# Altium schematic sheet Charging.SchDoc
size A; SheetNumber: 4
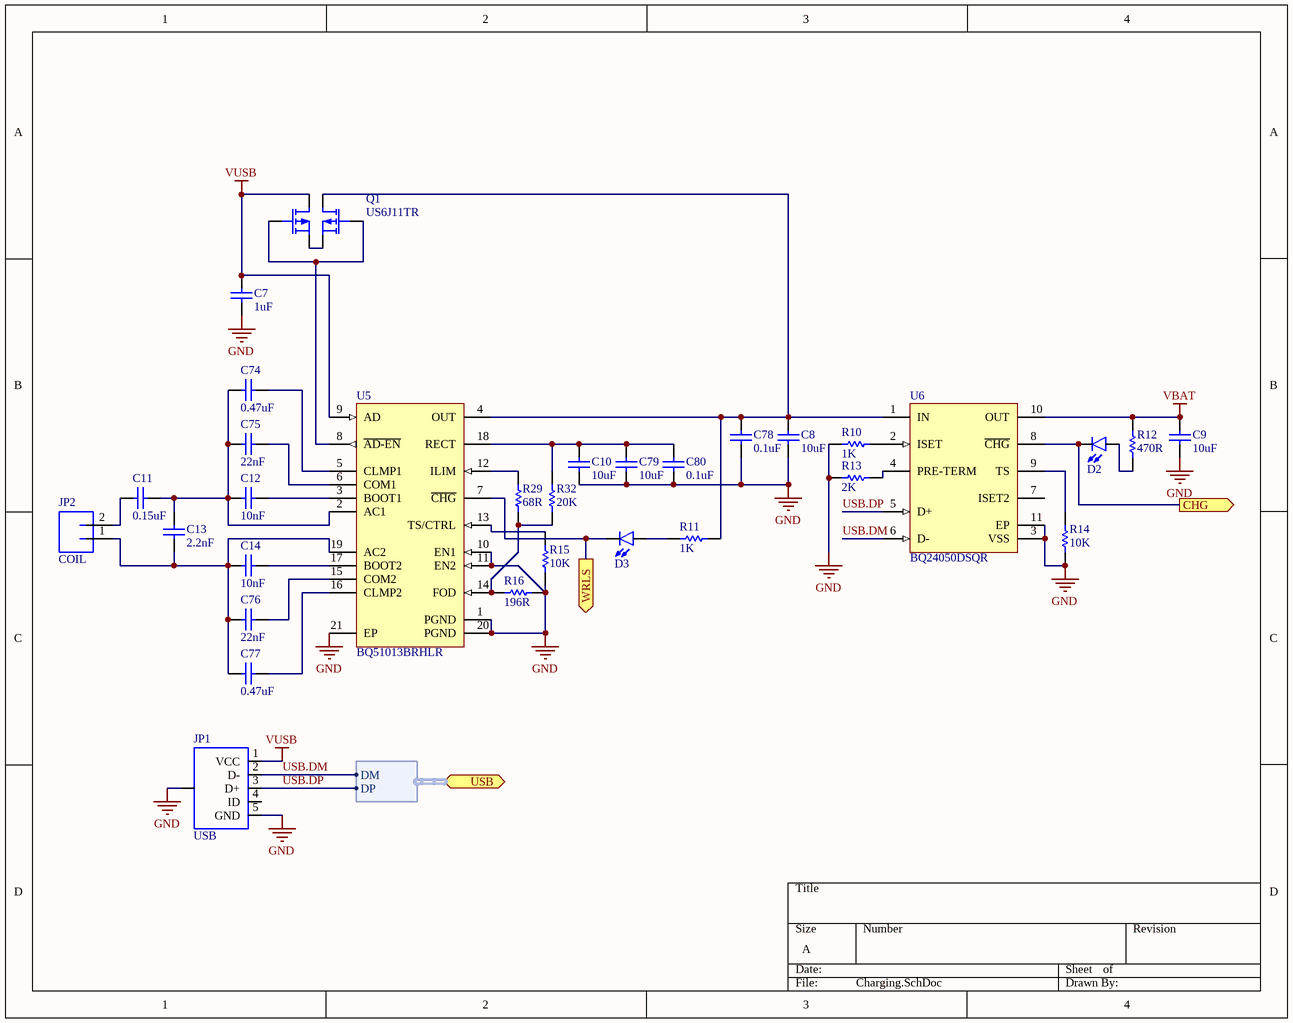
[diagram p0: Charging.SchDoc]

## Parts
C7  value 1uF  [C0402[1005X55]]  (hidden comment: 1uF 6.3V 0402)
C8  value 10uF  [C0402[1005X55]]  (hidden comment: 10uF 6.3V 0402)
C9  value 10uF  [C0402[1005X55]]  (hidden comment: 10uF 6.3V 0402)
C10  value 10uF  [C0603[1608X92]]  (hidden comment: 10uF 16V 0603)
C11  value 0.15uF  [C0402[1005X55]]  (hidden comment: 0.15uF 25V 0402)
C12  value 10nF  [C0402[1005X55]]  (hidden comment: 10nF 50V 0402)
C13  value 2.2nF  [C0402[1005X55]]  (hidden comment: 2.2nF 50V 0402)
C14  value 10nF  [C0402[1005X55]]  (hidden comment: 10nF 50V 0402)
C74  value 0.47uF  [C0402[1005X55]]  (hidden comment: 0.47uF 25V 0402)
C75  value 22nF  [C0402[1005X55]]  (hidden comment: 22nF 50V 0402)
C76  value 22nF  [C0402[1005X55]]  (hidden comment: 22nF 50V 0402)
C77  value 0.47uF  [C0402[1005X55]]  (hidden comment: 0.47uF 25V 0402)
C78  value 0.1uF  [C0402[1005X55]]  (hidden comment: 0.1uF 6.3V 0402)
C79  value 10uF  [C0603[1608X92]]  (hidden comment: 10uF 16V 0603)
C80  value 0.1uF  [C0402[1005X55]]  (hidden comment: 0.1uF 100V 0402)
D2  LED_0603_GREEN_5mA  [LED0603]  (value not drawn)
D3  LED_0603_ORANGE_5mA  [LED0603]  (value not drawn)
JP1  USB  [USB-MICROB]
JP2  COIL  [JST-SH-2-SMD-HORZ]
Q1  US6J11TR  [SOT-363-6FL]
R10  value 1K  [R0402[1005]]  (hidden comment: 1K 1% 0402)
R11  value 1K  [R0402[1005]]  (hidden comment: 1K 1% 0402)
R12  value 470R  [R0402[1005]]  (hidden comment: 470R 1% 0402)
R13  value 2K  [R0402[1005]]  (hidden comment: 2K 1% 0402)
R14  value 10K  [R0402[1005]]  (hidden comment: 10K 1% 0402)
R15  value 10K  [R0402[1005]]  (hidden comment: 10K 1% 0402)
R16  value 196R  [R0402[1005]]  (hidden comment: 196R 1% 0402)
R29  value 68R  [R0402[1005]]  (hidden comment: 68R 1% 0402)
R32  value 20K  [R0402[1005]]  (hidden comment: 20K 1% 0402)
U5  BQ51013BRHLR  [VQFN-20]
U6  BQ24050DSQR  [WSON-10]

## Ports
CHG (out), USB (harness USB), WRLS (out)

## Harnesses
USB: DM, DP

## Nets
GND: C7.1 C8.1 C9.1 C10.1 C78.1 C79.1 C80.1 JP1.5(GND) JP1.6(SHIELD) R10.1 R13.1 R14.1 R15.1 R16.2 U5.1(PGND) U5.10(EN1) U5.11(EN2) U5.20(PGND) U5.21(EP) U6.3(VSS) U6.11(EP)
VBAT: C9.2 R12.2 U6.10(OUT)
VUSB: C7.2 JP1.1(VCC) Q1.3(D2) U5.9(AD)
CHG: D2.C U6.8(~{CHG}) ; port CHG
USB.DM: JP1.2(D-) U6.6(D-) ; port USB.DM
USB.DP: JP1.3(D+) U6.5(D+) ; port USB.DP
WRLS: D3.C U5.7(~{CHG}) ; port WRLS
NetC8_2: C8.2 C78.2 Q1.6(D1) R11.1 U5.4(OUT) U6.1(IN)
NetC10_2: C10.2 C79.2 C80.2 R32.2 U5.18(RECT)
NetC11_1: C11.1 JP2.2
NetC11_2: C11.2 C12.2 C13.2 C74.1 C75.1 U5.2(AC1)
NetC12_1: C12.1 U5.3(BOOT1)
NetC13_1: C13.1 C14.2 C76.1 C77.1 JP2.1 U5.19(AC2)
NetC14_1: C14.1 U5.17(BOOT2)
NetC74_2: C74.2 U5.5(CLMP1)
NetC75_2: C75.2 U5.6(COM1)
NetC76_2: C76.2 U5.15(COM2)
NetC77_2: C77.2 U5.16(CLMP2)
NetD2_A: D2.A R12.1
NetD3_A: D3.A R11.2
NetQ1_1: Q1.1(S1) Q1.4(S2)
NetQ1_2: Q1.2(G1) Q1.5(G2) U5.8(~{AD-EN})
NetR10_2: R10.2 U6.2(ISET)
NetR13_2: R13.2 U6.4(PRE-TERM)
NetR14_2: R14.2 U6.9(TS)
NetR15_2: R15.2 U5.13(TS/CTRL)
NetR16_1: R16.1 R29.1 R32.1 U5.14(FOD)
NetR29_2: R29.2 U5.12(ILIM)

Not connected (* = marked no-connect by the designer): JP1 4(ID); U6 7(ISET2)

## Library data of the parts
C7 = CAP_1uF_6.3V_0402_10%: 1uF 6.3V 10% 0402 (1005 Metric); PartNumber: GRM155R70J105KA12D; Manufacturer: Murata; Mounting Technology: Surface Mount; PackageReference: 0402; PackageDescription: 0402 (1005 Metric); Voltage: 6.3V; Tolerance: 10%
C8 C9 = CAP_10uF_6.3V_0402_20%: 10uF 6.3V 20% 0402 (1005 Metric); PartNumber: GRM155R60J106ME44D; Manufacturer: Murata; Mounting Technology: Surface Mount; PackageReference: 0402; PackageDescription: 0402 (1005 Metric); Voltage: 6.3V; Tolerance: 20%
C10 C79 = CAP_10uF_16V_0603_10%: 10uF 16V 10% 0603 (1608 Metric); PartNumber: GRM188R61C106KAALD; Manufacturer: Murata; Mounting Technology: Surface Mount; PackageReference: 0603; PackageDescription: 0603 (1608 Metric); Voltage: 16V; Tolerance: 10%
C11 = CAP_0.15uF_25V_0402_10%: 0.15uF 25V 10% 0402 (1005 Metric); PartNumber: C1005X6S1E154K050BC; Manufacturer: TDK; Mounting Technology: Surface Mount; PackageReference: 0402; PackageDescription: 0402 (1005 Metric); Voltage: 25V; Tolerance: 10%
C12 C14 = CAP_10nF_50V_0402_10%: 10nF 50V 10% 0402 (1005 Metric); PartNumber: GCM155R71H103KA55D; Manufacturer: Murata; Mounting Technology: Surface Mount; PackageReference: 0402; PackageDescription: 0402 (1005 Metric); Voltage: 50V; Tolerance: 10%
C13 = CAP_2.2nF_50V_0402_10%: 2.2nF 50V 10% 0402 (1005 Metric); PartNumber: GCM155R71H222KA37D; Manufacturer: Murata; Mounting Technology: Surface Mount; PackageReference: 0402; PackageDescription: 0402 (1005 Metric); Voltage: 50V; Tolerance: 10%
C74 C77 = CAP_0.47uF_25V_0402_10%: 0.47uF 25V 10% 0402 (1005 Metric); PartNumber: GRM155R61E474KE01D; Manufacturer: Murata; Mounting Technology: Surface Mount; PackageReference: 0402; PackageDescription: 0402 (1005 Metric); Voltage: 25V; Tolerance: 10%
C75 C76 = CAP_22nF_50V_0402_10%: 22nF 50V 10% 0402 (1005 Metric); PartNumber: GRM155R71H223KA12J; Manufacturer: Murata; Mounting Technology: Surface Mount; PackageReference: 0402; PackageDescription: 0402 (1005 Metric); Voltage: 50V; Tolerance: 10%
C78 = CAP_0.1uF_6.3V_0402_10%: 0.1uF 6.3V 10% 0402 (1005 Metric); PartNumber: GRM155R70J104KA01D; Manufacturer: Murata; Mounting Technology: Surface Mount; PackageReference: 0402; PackageDescription: 0402 (1005 Metric); Voltage: 6.3V; Tolerance: 10%
C80 = CAP_0.1uF_100V_0402_10%: 0.1uF 100V 10% 0402 (1005 Metric); PartNumber: GRM155R62A104KE14D; Manufacturer: Murata; Mounting Technology: Surface Mount; PackageReference: 0402; PackageDescription: 0402 (1005 Metric); Voltage: 100V; Tolerance: 10%
D2 = LED_0603_GREEN_5mA: PartNumber: LTST-C193TGKT-5A; Manufacturer: Lite-On Inc.; PackageReference: 0603; PackageDescription: 0603 (1608 Metric); Mounting Technology: Surface Mount
D3 = LED_0603_ORANGE_5mA: PartNumber: LTST-C193KFKT-5A; Manufacturer: Lite-On Inc.; PackageReference: 0603; PackageDescription: 0603 (1608 Metric); Mounting Technology: Surface Mount
JP1 = USB_MICROB_SMT: pin to pad: 1>VBUS 2>D- 3>D+ 4>ID 5>GND 6>MT1+P$1+P$2+MT2; PartNumber: 10118192-0001LF; Manufacturer: Amphenol FCI; Mounting Technology: Surface Mount; PackageReference: USB - Micro B
JP2 = JST_SH_2_HORZ: Manufacturer: JST Sales America, Inc.; PartNumber: SM02B-SRSS-TB; Mounting Technology: Surface Mount; PackageReference: JST-SH
Q1 = US6J11TR: P-Channel MOSFET; Manufacturer: ON Semiconductor; Mounting Technology: Surface Mount; PartNumber: US6J11TR; PackageReference: TUMT-6
R10 R11 = RES_1K_0402_1%: 1K 0.063W 1% 0402 (1005 Metric); Manufacturer: KOA Speer; PartNumber: RK73H1ETTP1001F; Tolerance: 1%; Power: 0.063W; Mounting Technology: Surface Mount; PackageReference: 0402; PackageDescription: 0402 (1005 Metric); ComponentLink1Description: Datasheet; ComponentLink1URL: http://www.koaspeer.com/catimages/Products/RK73H/RK73H.pdf
R12 = RES_470R_0402_1%: 470R 0.063W 1% 0402 (1005 Metric); Manufacturer: KOA Speer; PartNumber: RK73H1ETTP4700F; Tolerance: 1%; Power: 0.063W; Mounting Technology: Surface Mount; PackageReference: 0402; PackageDescription: 0402 (1005 Metric); ComponentLink1Description: Datasheet; ComponentLink1URL: http://www.koaspeer.com/catimages/Products/RK73H/RK73H.pdf
R13 = RES_2K_0402_1%: 2K 0.063W 1% 0402 (1005 Metric); Manufacturer: KOA Speer; PartNumber: RK73H1ETTP2001F; Tolerance: 1%; Power: 0.063W; Mounting Technology: Surface Mount; PackageReference: 0402; PackageDescription: 0402 (1005 Metric); ComponentLink1Description: Datasheet; ComponentLink1URL: http://www.koaspeer.com/catimages/Products/RK73H/RK73H.pdf
R14 R15 = RES_10K_0402_1%: 10K 0.063W 1% 0402 (1005 Metric); Manufacturer: KOA Speer; PartNumber: RK73H1ETTP1002F; Tolerance: 1%; Power: 0.063W; Mounting Technology: Surface Mount; PackageReference: 0402; PackageDescription: 0402 (1005 Metric); ComponentLink1Description: Datasheet; ComponentLink1URL: http://www.koaspeer.com/catimages/Products/RK73H/RK73H.pdf
R16 = RES_196R_0402_1%: 196R 0.063W 1% 0402 (1005 Metric); Manufacturer: KOA Speer; PartNumber: RK73H1ETTP1960F; Tolerance: 1%; Power: 0.063W; Mounting Technology: Surface Mount; PackageReference: 0402; PackageDescription: 0402 (1005 Metric); ComponentLink1Description: Datasheet; ComponentLink1URL: http://www.koaspeer.com/catimages/Products/RK73H/RK73H.pdf
R29 = RES_68R_0402_1%: 68R 0.063W 1% 0402 (1005 Metric); Manufacturer: KOA Speer; PartNumber: RK73H1ETTP68R0F; Tolerance: 1%; Power: 0.063W; Mounting Technology: Surface Mount; PackageReference: 0402; PackageDescription: 0402 (1005 Metric); ComponentLink1Description: Datasheet; ComponentLink1URL: http://www.koaspeer.com/catimages/Products/RK73H/RK73H.pdf
R32 = RES_20K_0402_1%: 20K 0.063W 1% 0402 (1005 Metric); Manufacturer: KOA Speer; PartNumber: RK73H1ETTP2002F; Tolerance: 1%; Power: 0.063W; Mounting Technology: Surface Mount; PackageReference: 0402; PackageDescription: 0402 (1005 Metric); ComponentLink1Description: Datasheet; ComponentLink1URL: http://www.koaspeer.com/catimages/Products/RK73H/RK73H.pdf
U5 = BQ51013BRHLR: Manufacturer: Texas Instruments; Mounting Technology: Surface Mount; PartNumber: BQ51013BRHLR; PackageReference: VQFN-20
U6 = BQ24050DSQR: Manufacturer: Texas Instruments; PartNumber: BQ24050DSQR; Mounting Technology: Surface Mount; PackageReference: WSON-10